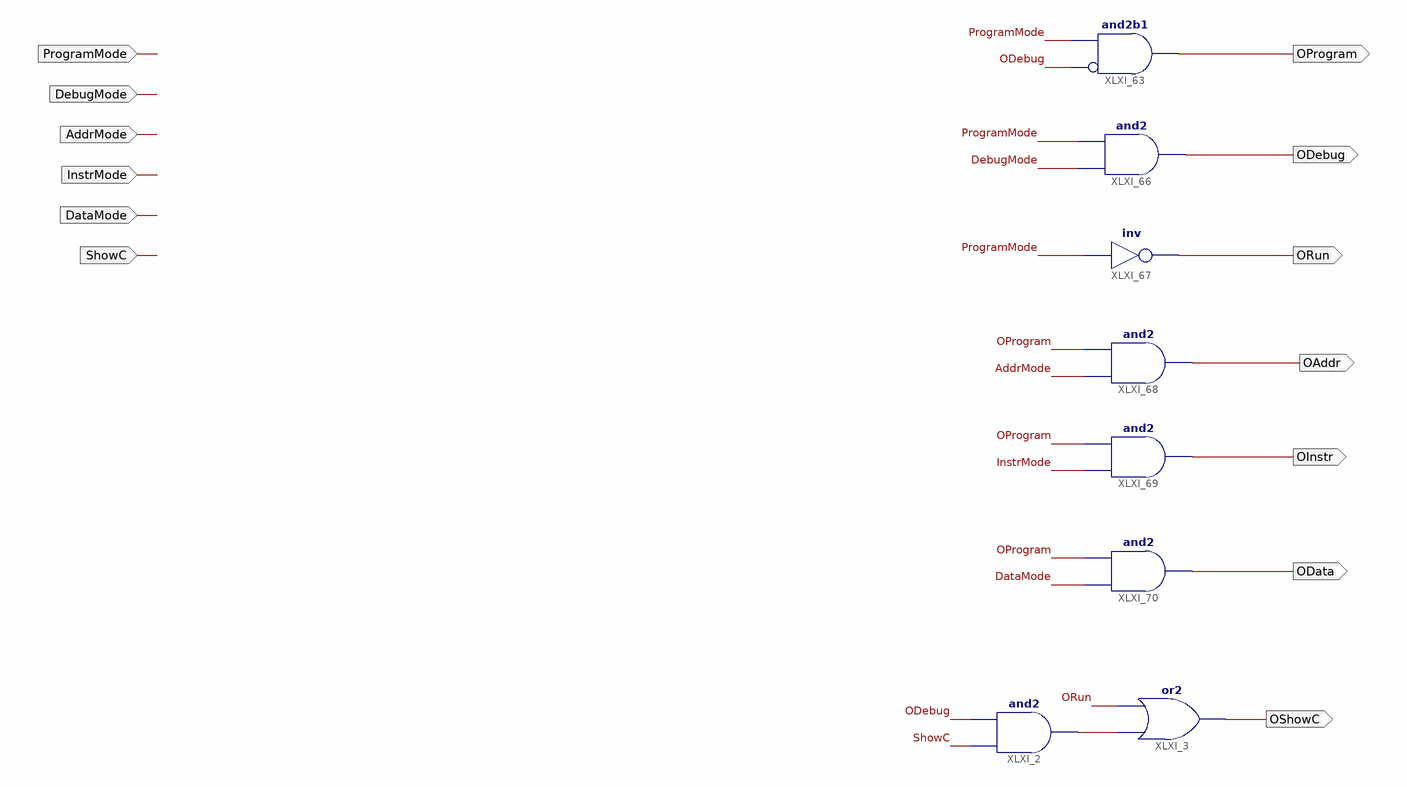
[diagram p0: schematic sheet 1]
// Xilinx ISE schematic InputState.sch (spartan3e) as structural Verilog: 8 symbols, 13 ports
module InputState (
  input  ProgramMode,
  input  DebugMode,
  input  AddrMode,
  input  InstrMode,
  input  DataMode,
  input  ShowC,
  output OProgram,
  output ODebug,
  output ORun,
  output OAddr,
  output OInstr,
  output OData,
  output OShowC
);

  wire XLXN_52;

  or XLXI_3 (OShowC, XLXN_52, ORun);
  and XLXI_2 (XLXN_52, ShowC, ODebug);
  and XLXI_63 (OProgram, ~ODebug, ProgramMode);  // and2b1
  and XLXI_66 (ODebug, DebugMode, ProgramMode);
  not XLXI_67 (ORun, ProgramMode);
  and XLXI_68 (OAddr, AddrMode, OProgram);
  and XLXI_69 (OInstr, InstrMode, OProgram);
  and XLXI_70 (OData, DataMode, OProgram);
endmodule
